# EAGLE design LED-zero-SHIM (EAGLE 9.6.2)

## Sheet 1 of 2
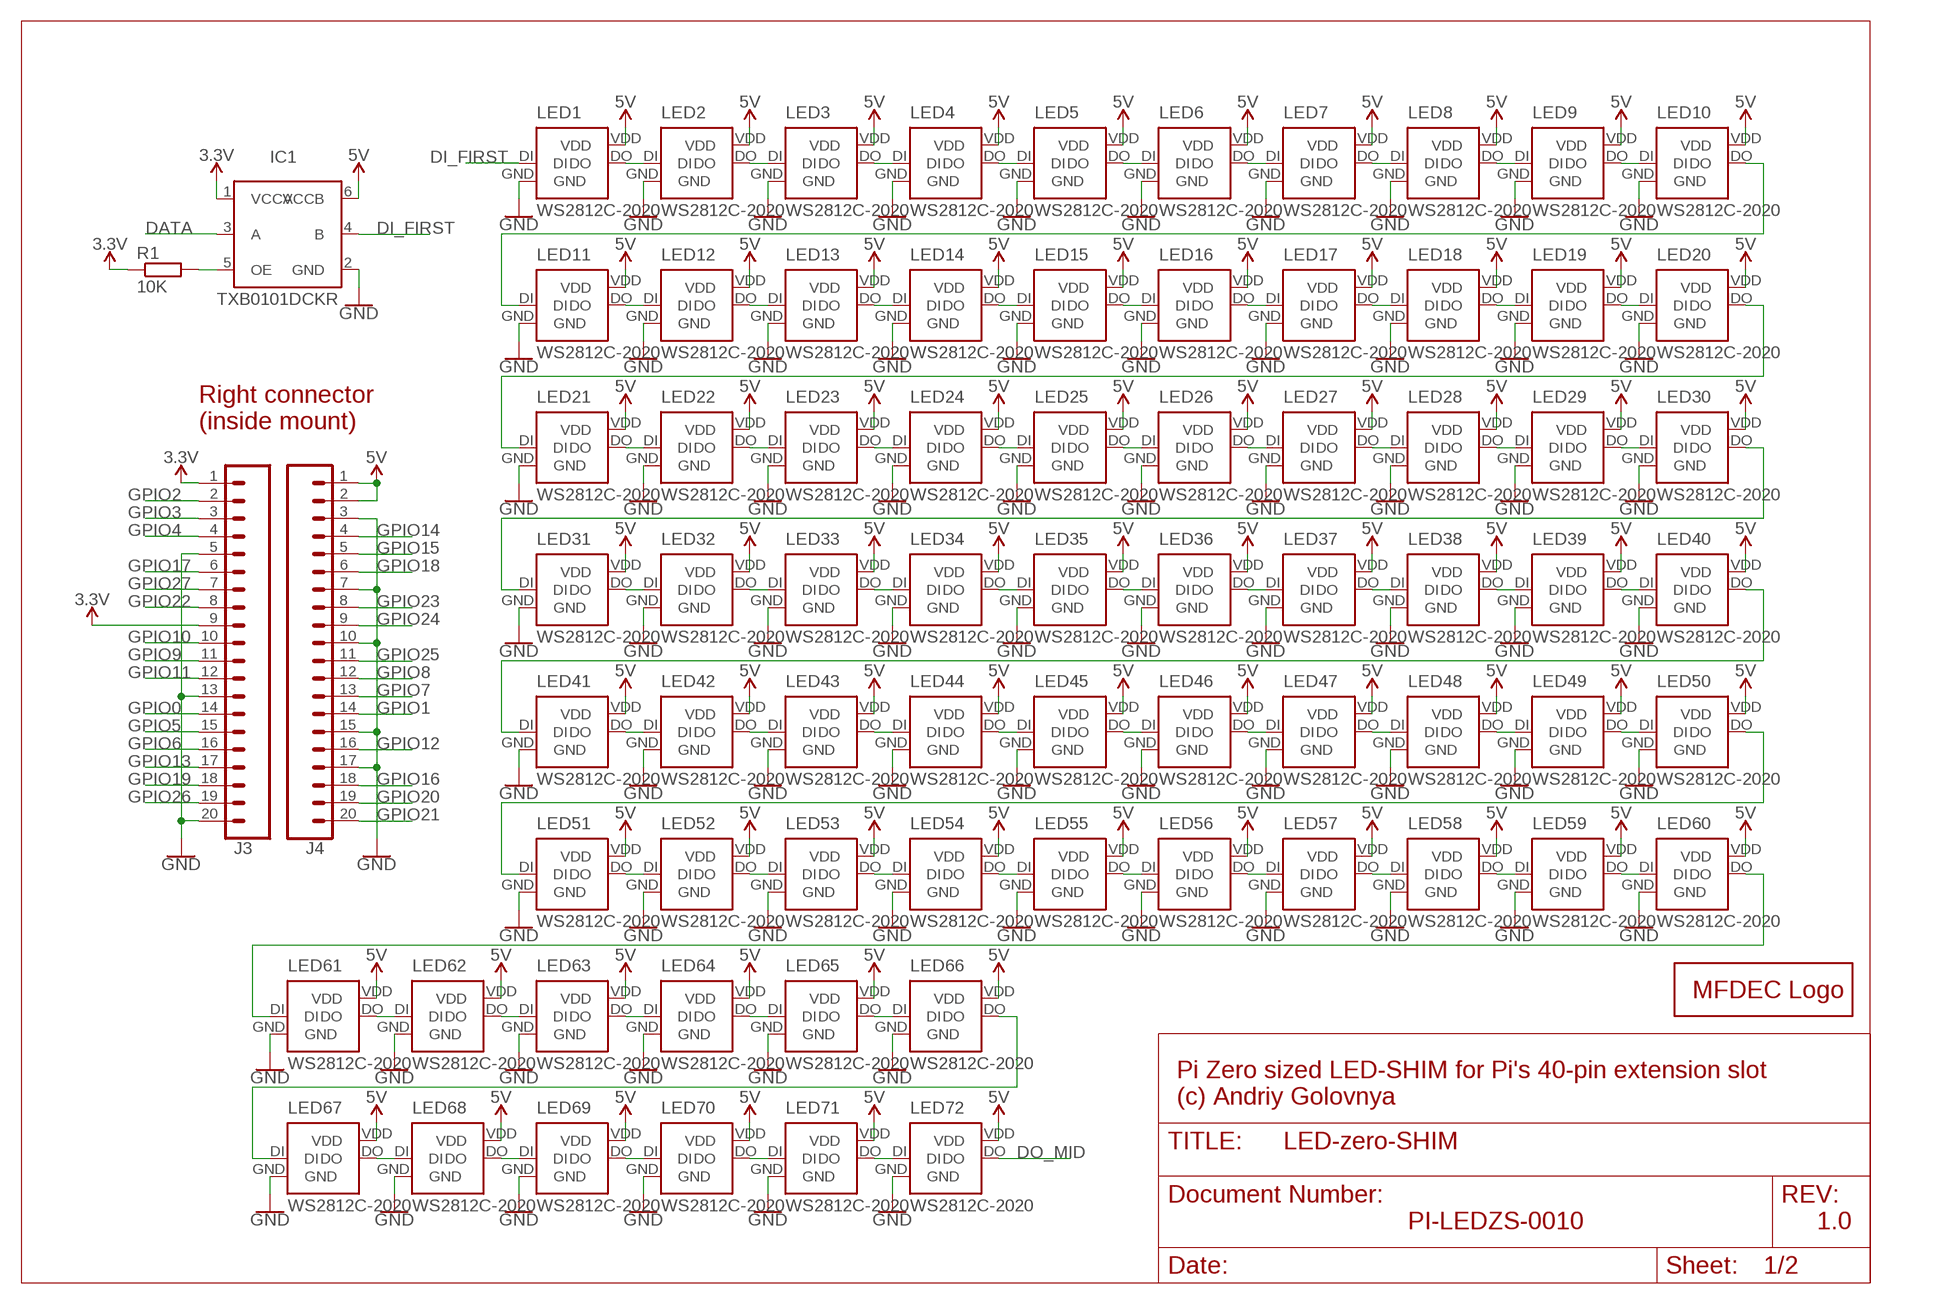
[diagram p0: schematic, sheet 1]

### Parts
IC1  TXB0101DCKR  [SOT65P210X110-6N]
J3  CONN_20LOCK  [1X20_LOCK]
J4  CONN_20LOCK  [1X20_LOCK]
LED1  WS2812C-2020  [WS2812X-2020]
LED2  WS2812C-2020  [WS2812X-2020]
LED3  WS2812C-2020  [WS2812X-2020]
LED4  WS2812C-2020  [WS2812X-2020]
LED5  WS2812C-2020  [WS2812X-2020]
LED6  WS2812C-2020  [WS2812X-2020]
LED7  WS2812C-2020  [WS2812X-2020]
LED8  WS2812C-2020  [WS2812X-2020]
LED9  WS2812C-2020  [WS2812X-2020]
LED10  WS2812C-2020  [WS2812X-2020]
LED11  WS2812C-2020  [WS2812X-2020]
LED12  WS2812C-2020  [WS2812X-2020]
LED13  WS2812C-2020  [WS2812X-2020]
LED14  WS2812C-2020  [WS2812X-2020]
LED15  WS2812C-2020  [WS2812X-2020]
LED16  WS2812C-2020  [WS2812X-2020]
LED17  WS2812C-2020  [WS2812X-2020]
LED18  WS2812C-2020  [WS2812X-2020]
LED19  WS2812C-2020  [WS2812X-2020]
LED20  WS2812C-2020  [WS2812X-2020]
LED21  WS2812C-2020  [WS2812X-2020]
LED22  WS2812C-2020  [WS2812X-2020]
LED23  WS2812C-2020  [WS2812X-2020]
LED24  WS2812C-2020  [WS2812X-2020]
LED25  WS2812C-2020  [WS2812X-2020]
LED26  WS2812C-2020  [WS2812X-2020]
LED27  WS2812C-2020  [WS2812X-2020]
LED28  WS2812C-2020  [WS2812X-2020]
LED29  WS2812C-2020  [WS2812X-2020]
LED30  WS2812C-2020  [WS2812X-2020]
LED31  WS2812C-2020  [WS2812X-2020]
LED32  WS2812C-2020  [WS2812X-2020]
LED33  WS2812C-2020  [WS2812X-2020]
LED34  WS2812C-2020  [WS2812X-2020]
LED35  WS2812C-2020  [WS2812X-2020]
LED36  WS2812C-2020  [WS2812X-2020]
LED37  WS2812C-2020  [WS2812X-2020]
LED38  WS2812C-2020  [WS2812X-2020]
LED39  WS2812C-2020  [WS2812X-2020]
LED40  WS2812C-2020  [WS2812X-2020]
LED41  WS2812C-2020  [WS2812X-2020]
LED42  WS2812C-2020  [WS2812X-2020]
LED43  WS2812C-2020  [WS2812X-2020]
LED44  WS2812C-2020  [WS2812X-2020]
LED45  WS2812C-2020  [WS2812X-2020]
LED46  WS2812C-2020  [WS2812X-2020]
LED47  WS2812C-2020  [WS2812X-2020]
LED48  WS2812C-2020  [WS2812X-2020]
LED49  WS2812C-2020  [WS2812X-2020]
LED50  WS2812C-2020  [WS2812X-2020]
LED51  WS2812C-2020  [WS2812X-2020]
LED52  WS2812C-2020  [WS2812X-2020]
LED53  WS2812C-2020  [WS2812X-2020]
LED54  WS2812C-2020  [WS2812X-2020]
LED55  WS2812C-2020  [WS2812X-2020]
LED56  WS2812C-2020  [WS2812X-2020]
LED57  WS2812C-2020  [WS2812X-2020]
LED58  WS2812C-2020  [WS2812X-2020]
LED59  WS2812C-2020  [WS2812X-2020]
LED60  WS2812C-2020  [WS2812X-2020]
LED61  WS2812C-2020  [WS2812X-2020]
LED62  WS2812C-2020  [WS2812X-2020]
LED63  WS2812C-2020  [WS2812X-2020]
LED64  WS2812C-2020  [WS2812X-2020]
LED65  WS2812C-2020  [WS2812X-2020]
LED66  WS2812C-2020  [WS2812X-2020]
LED67  WS2812C-2020  [WS2812X-2020]
LED68  WS2812C-2020  [WS2812X-2020]
LED69  WS2812C-2020  [WS2812X-2020]
LED70  WS2812C-2020  [WS2812X-2020]
LED71  WS2812C-2020  [WS2812X-2020]
LED72  WS2812C-2020  [WS2812X-2020]
LOGO1  MFDECLOGO_L_30MM  [MFDEC_L_30MM]
R1  10K  R-EU_R0402  [R0402]

### Nets
3.3V: IC1.1(VCCA) J3.1 J3.9 R1.1
5V: IC1.6(VCCB) J4.1 J4.2 LED1.VDD LED2.VDD LED3.VDD LED4.VDD LED5.VDD LED6.VDD LED7.VDD LED8.VDD LED9.VDD LED10.VDD LED11.VDD LED12.VDD LED13.VDD LED14.VDD LED15.VDD LED16.VDD LED17.VDD LED18.VDD LED19.VDD LED20.VDD LED21.VDD LED22.VDD LED23.VDD LED24.VDD LED25.VDD LED26.VDD LED27.VDD LED28.VDD LED29.VDD LED30.VDD LED31.VDD LED32.VDD LED33.VDD LED34.VDD LED35.VDD LED36.VDD LED37.VDD LED38.VDD LED39.VDD LED40.VDD LED41.VDD LED42.VDD LED43.VDD LED44.VDD LED45.VDD LED46.VDD LED47.VDD LED48.VDD LED49.VDD LED50.VDD LED51.VDD LED52.VDD LED53.VDD LED54.VDD LED55.VDD LED56.VDD LED57.VDD LED58.VDD LED59.VDD LED60.VDD LED61.VDD LED62.VDD LED63.VDD LED64.VDD LED65.VDD LED66.VDD LED67.VDD LED68.VDD LED69.VDD LED70.VDD LED71.VDD LED72.VDD ; also sheet 2
DATA: IC1.3(A) ; also sheet 2
DI_FIRST: IC1.4(B) LED1.DI ; also sheet 2
DO_MID: LED72.DO ; also sheet 2
GND: IC1.2(GND) J3.5 J3.13 J3.20 J4.3 J4.7 J4.10 J4.15 J4.17 LED1.GND LED2.GND LED3.GND LED4.GND LED5.GND LED6.GND LED7.GND LED8.GND LED9.GND LED10.GND LED11.GND LED12.GND LED13.GND LED14.GND LED15.GND LED16.GND LED17.GND LED18.GND LED19.GND LED20.GND LED21.GND LED22.GND LED23.GND LED24.GND LED25.GND LED26.GND LED27.GND LED28.GND LED29.GND LED30.GND LED31.GND LED32.GND LED33.GND LED34.GND LED35.GND LED36.GND LED37.GND LED38.GND LED39.GND LED40.GND LED41.GND LED42.GND LED43.GND LED44.GND LED45.GND LED46.GND LED47.GND LED48.GND LED49.GND LED50.GND LED51.GND LED52.GND LED53.GND LED54.GND LED55.GND LED56.GND LED57.GND LED58.GND LED59.GND LED60.GND LED61.GND LED62.GND LED63.GND LED64.GND LED65.GND LED66.GND LED67.GND LED68.GND LED69.GND LED70.GND LED71.GND LED72.GND ; also sheet 2
GPIO0: J3.14
GPIO1: J4.14
GPIO2: J3.2
GPIO3: J3.3
GPIO4: J3.4
GPIO5: J3.15
GPIO6: J3.16
GPIO7: J4.13
GPIO8: J4.12
GPIO9: J3.11
GPIO10: J3.10 ; also sheet 2
GPIO11: J3.12
GPIO12: J4.16
GPIO13: J3.17
GPIO14: J4.4
GPIO15: J4.5
GPIO16: J4.18
GPIO17: J3.6
GPIO18: J4.6 ; also sheet 2
GPIO19: J3.18
GPIO20: J4.19
GPIO21: J4.20 ; also sheet 2
GPIO22: J3.8
GPIO23: J4.8
GPIO24: J4.9
GPIO25: J4.11
GPIO26: J3.19
GPIO27: J3.7
N$1: LED1.DO LED2.DI
N$2: LED2.DO LED3.DI
N$3: LED3.DO LED4.DI
N$4: LED4.DO LED5.DI
N$5: LED5.DO LED6.DI
N$6: LED6.DO LED7.DI
N$7: LED7.DO LED8.DI
N$8: LED8.DO LED9.DI
N$9: LED9.DO LED10.DI
N$10: LED10.DO LED11.DI
N$11: LED11.DO LED12.DI
N$12: LED12.DO LED13.DI
N$13: LED13.DO LED14.DI
N$14: LED14.DO LED15.DI
N$15: LED15.DO LED16.DI
N$16: LED16.DO LED17.DI
N$17: LED17.DO LED18.DI
N$18: LED18.DO LED19.DI
N$19: LED19.DO LED20.DI
N$20: LED20.DO LED21.DI
N$21: LED21.DO LED22.DI
N$22: LED22.DO LED23.DI
N$23: LED23.DO LED24.DI
N$24: LED24.DO LED25.DI
N$25: LED25.DO LED26.DI
N$26: LED26.DO LED27.DI
N$27: LED27.DO LED28.DI
N$28: LED28.DO LED29.DI
N$29: LED29.DO LED30.DI
N$30: LED30.DO LED31.DI
N$31: LED31.DO LED32.DI
N$32: LED32.DO LED33.DI
N$33: LED33.DO LED34.DI
N$34: LED34.DO LED35.DI
N$35: LED35.DO LED36.DI
N$36: LED36.DO LED37.DI
N$37: LED37.DO LED38.DI
N$38: LED38.DO LED39.DI
N$39: LED39.DO LED40.DI
N$40: LED40.DO LED41.DI
N$41: LED41.DO LED42.DI
N$42: LED42.DO LED43.DI
N$43: LED43.DO LED44.DI
N$44: LED44.DO LED45.DI
N$45: LED45.DO LED46.DI
N$46: LED46.DO LED47.DI
N$47: LED47.DO LED48.DI
N$48: LED48.DO LED49.DI
N$49: LED49.DO LED50.DI
N$50: LED50.DO LED51.DI
N$51: LED51.DO LED52.DI
N$52: LED52.DO LED53.DI
N$53: LED53.DO LED54.DI
N$54: LED54.DO LED55.DI
N$55: LED55.DO LED56.DI
N$56: LED56.DO LED57.DI
N$57: LED57.DO LED58.DI
N$58: LED58.DO LED59.DI
N$59: LED59.DO LED60.DI
N$60: LED60.DO LED61.DI
N$61: LED61.DO LED62.DI
N$62: LED62.DO LED63.DI
N$63: LED63.DO LED64.DI
N$64: LED64.DO LED65.DI
N$65: LED65.DO LED66.DI
N$66: LED66.DO LED67.DI
N$67: LED67.DO LED68.DI
N$68: LED68.DO LED69.DI
N$69: LED69.DO LED70.DI
N$70: LED70.DO LED71.DI
N$71: LED71.DO LED72.DI
N$143: IC1.5(OE) R1.2

### Notes on the sheet
- Right connector
  (inside mount)
- Pi Zero sized LED-SHIM for Pi's 40-pin extension slot
  (c) Andriy Golovnya
- PI-LEDZS-0010 | 1.0

## Sheet 2 of 2
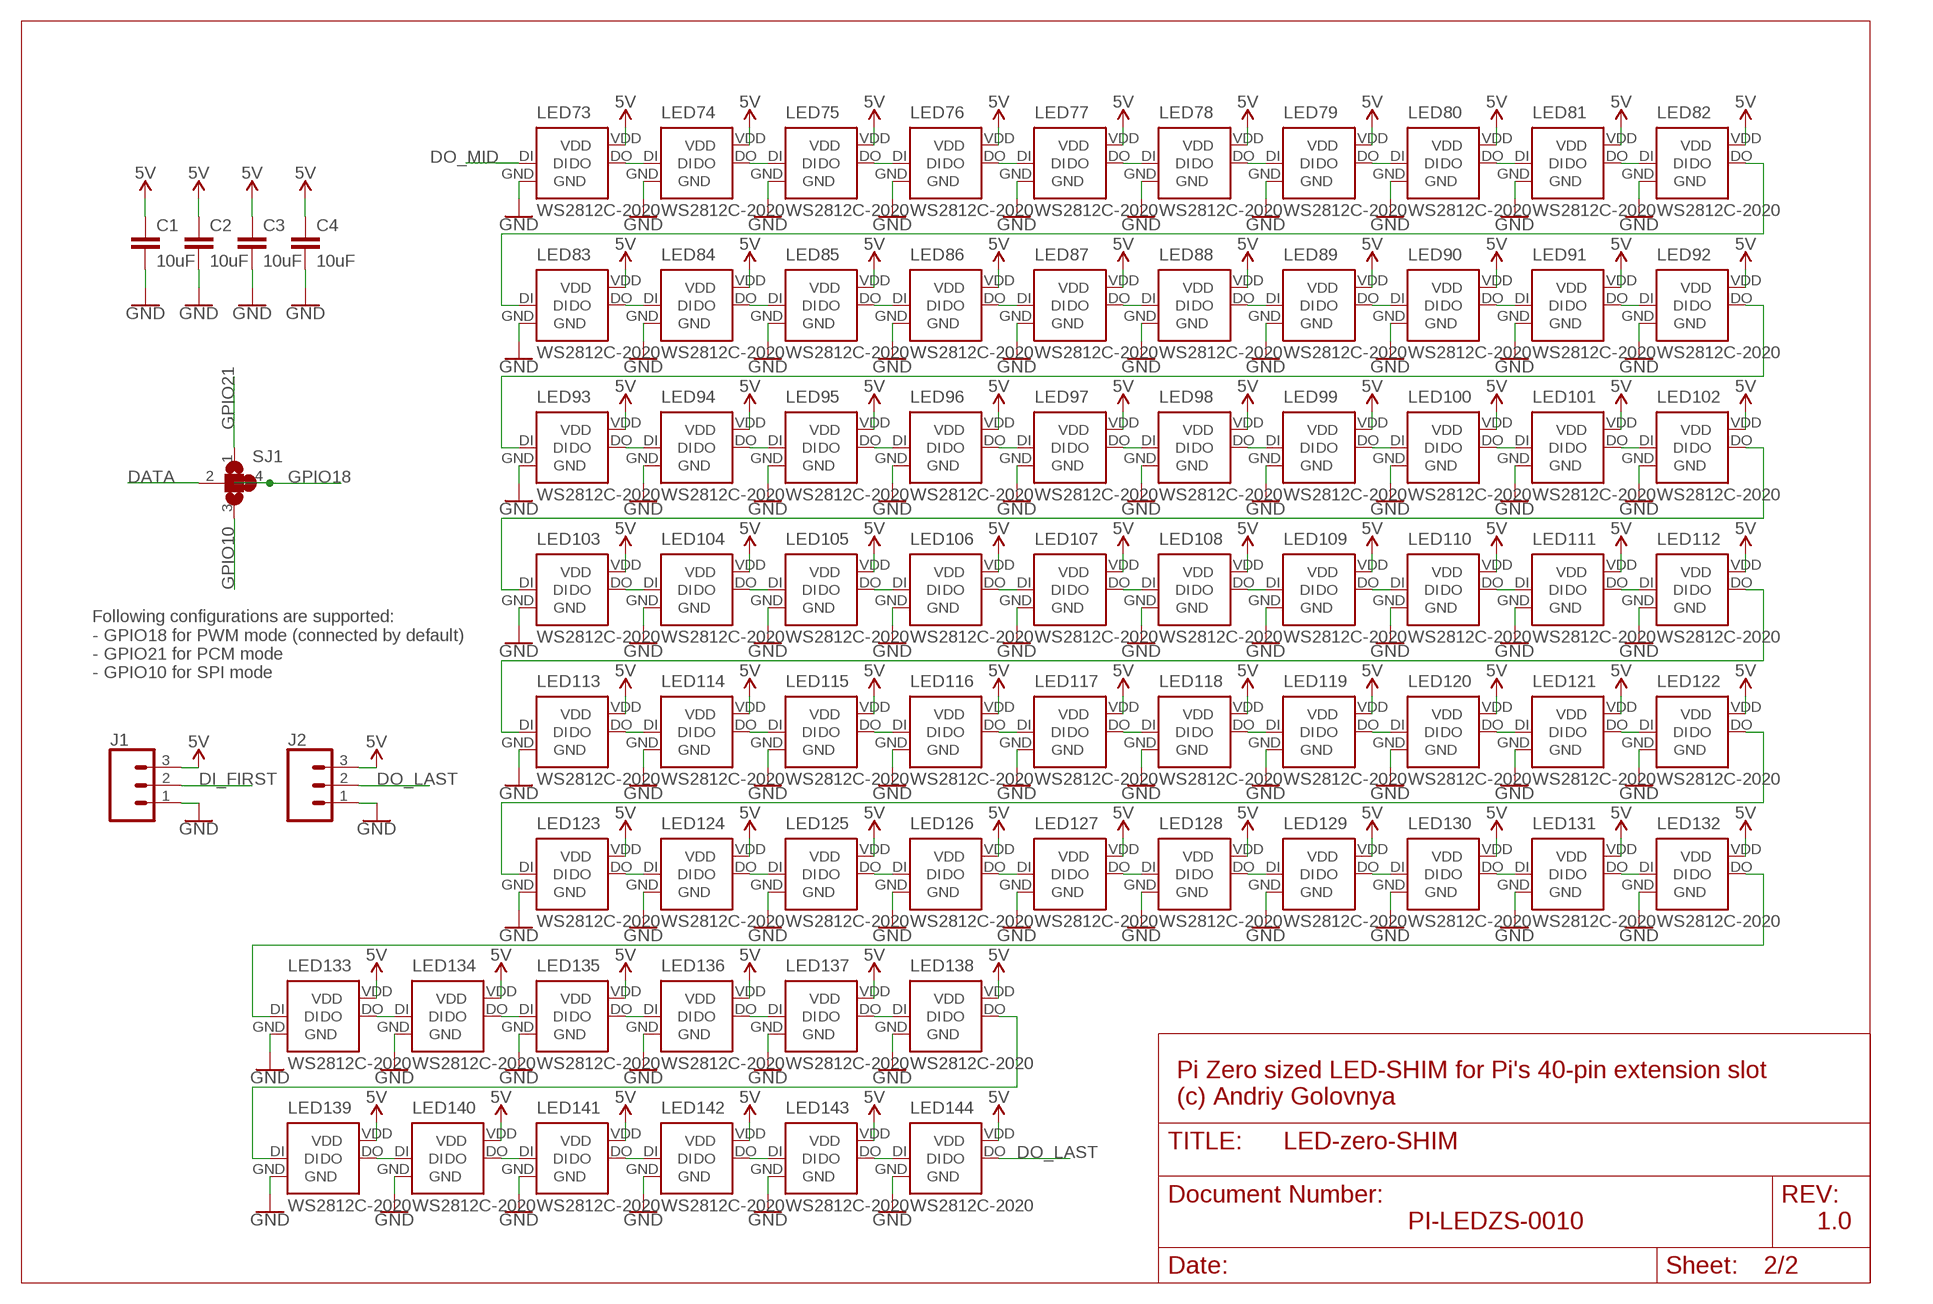
[diagram p1: schematic, sheet 2]

### Parts
C1  10uF  C-EUC0805  [C0805]
C2  10uF  C-EUC0805  [C0805]
C3  10uF  C-EUC0805  [C0805]
C4  10uF  C-EUC0805  [C0805]
J1  CONN_03  [1X03]
J2  CONN_03  [1X03]
LED73  WS2812C-2020  [WS2812X-2020]
LED74  WS2812C-2020  [WS2812X-2020]
LED75  WS2812C-2020  [WS2812X-2020]
LED76  WS2812C-2020  [WS2812X-2020]
LED77  WS2812C-2020  [WS2812X-2020]
LED78  WS2812C-2020  [WS2812X-2020]
LED79  WS2812C-2020  [WS2812X-2020]
LED80  WS2812C-2020  [WS2812X-2020]
LED81  WS2812C-2020  [WS2812X-2020]
LED82  WS2812C-2020  [WS2812X-2020]
LED83  WS2812C-2020  [WS2812X-2020]
LED84  WS2812C-2020  [WS2812X-2020]
LED85  WS2812C-2020  [WS2812X-2020]
LED86  WS2812C-2020  [WS2812X-2020]
LED87  WS2812C-2020  [WS2812X-2020]
LED88  WS2812C-2020  [WS2812X-2020]
LED89  WS2812C-2020  [WS2812X-2020]
LED90  WS2812C-2020  [WS2812X-2020]
LED91  WS2812C-2020  [WS2812X-2020]
LED92  WS2812C-2020  [WS2812X-2020]
LED93  WS2812C-2020  [WS2812X-2020]
LED94  WS2812C-2020  [WS2812X-2020]
LED95  WS2812C-2020  [WS2812X-2020]
LED96  WS2812C-2020  [WS2812X-2020]
LED97  WS2812C-2020  [WS2812X-2020]
LED98  WS2812C-2020  [WS2812X-2020]
LED99  WS2812C-2020  [WS2812X-2020]
LED100  WS2812C-2020  [WS2812X-2020]
LED101  WS2812C-2020  [WS2812X-2020]
LED102  WS2812C-2020  [WS2812X-2020]
LED103  WS2812C-2020  [WS2812X-2020]
LED104  WS2812C-2020  [WS2812X-2020]
LED105  WS2812C-2020  [WS2812X-2020]
LED106  WS2812C-2020  [WS2812X-2020]
LED107  WS2812C-2020  [WS2812X-2020]
LED108  WS2812C-2020  [WS2812X-2020]
LED109  WS2812C-2020  [WS2812X-2020]
LED110  WS2812C-2020  [WS2812X-2020]
LED111  WS2812C-2020  [WS2812X-2020]
LED112  WS2812C-2020  [WS2812X-2020]
LED113  WS2812C-2020  [WS2812X-2020]
LED114  WS2812C-2020  [WS2812X-2020]
LED115  WS2812C-2020  [WS2812X-2020]
LED116  WS2812C-2020  [WS2812X-2020]
LED117  WS2812C-2020  [WS2812X-2020]
LED118  WS2812C-2020  [WS2812X-2020]
LED119  WS2812C-2020  [WS2812X-2020]
LED120  WS2812C-2020  [WS2812X-2020]
LED121  WS2812C-2020  [WS2812X-2020]
LED122  WS2812C-2020  [WS2812X-2020]
LED123  WS2812C-2020  [WS2812X-2020]
LED124  WS2812C-2020  [WS2812X-2020]
LED125  WS2812C-2020  [WS2812X-2020]
LED126  WS2812C-2020  [WS2812X-2020]
LED127  WS2812C-2020  [WS2812X-2020]
LED128  WS2812C-2020  [WS2812X-2020]
LED129  WS2812C-2020  [WS2812X-2020]
LED130  WS2812C-2020  [WS2812X-2020]
LED131  WS2812C-2020  [WS2812X-2020]
LED132  WS2812C-2020  [WS2812X-2020]
LED133  WS2812C-2020  [WS2812X-2020]
LED134  WS2812C-2020  [WS2812X-2020]
LED135  WS2812C-2020  [WS2812X-2020]
LED136  WS2812C-2020  [WS2812X-2020]
LED137  WS2812C-2020  [WS2812X-2020]
LED138  WS2812C-2020  [WS2812X-2020]
LED139  WS2812C-2020  [WS2812X-2020]
LED140  WS2812C-2020  [WS2812X-2020]
LED141  WS2812C-2020  [WS2812X-2020]
LED142  WS2812C-2020  [WS2812X-2020]
LED143  WS2812C-2020  [WS2812X-2020]
LED144  WS2812C-2020  [WS2812X-2020]
SJ1  SJ3  [SJ_3]

### Nets
5V: C1.1 C2.1 C3.1 C4.1 J1.3 J2.3 LED73.VDD LED74.VDD LED75.VDD LED76.VDD LED77.VDD LED78.VDD LED79.VDD LED80.VDD LED81.VDD LED82.VDD LED83.VDD LED84.VDD LED85.VDD LED86.VDD LED87.VDD LED88.VDD LED89.VDD LED90.VDD LED91.VDD LED92.VDD LED93.VDD LED94.VDD LED95.VDD LED96.VDD LED97.VDD LED98.VDD LED99.VDD LED100.VDD LED101.VDD LED102.VDD LED103.VDD LED104.VDD LED105.VDD LED106.VDD LED107.VDD LED108.VDD LED109.VDD LED110.VDD LED111.VDD LED112.VDD LED113.VDD LED114.VDD LED115.VDD LED116.VDD LED117.VDD LED118.VDD LED119.VDD LED120.VDD LED121.VDD LED122.VDD LED123.VDD LED124.VDD LED125.VDD LED126.VDD LED127.VDD LED128.VDD LED129.VDD LED130.VDD LED131.VDD LED132.VDD LED133.VDD LED134.VDD LED135.VDD LED136.VDD LED137.VDD LED138.VDD LED139.VDD LED140.VDD LED141.VDD LED142.VDD LED143.VDD LED144.VDD ; also sheet 1
DATA: SJ1.2 ; also sheet 1
DI_FIRST: J1.2 ; also sheet 1
DO_LAST: J2.2 LED144.DO
DO_MID: LED73.DI ; also sheet 1
GND: C1.2 C2.2 C3.2 C4.2 J1.1 J2.1 LED73.GND LED74.GND LED75.GND LED76.GND LED77.GND LED78.GND LED79.GND LED80.GND LED81.GND LED82.GND LED83.GND LED84.GND LED85.GND LED86.GND LED87.GND LED88.GND LED89.GND LED90.GND LED91.GND LED92.GND LED93.GND LED94.GND LED95.GND LED96.GND LED97.GND LED98.GND LED99.GND LED100.GND LED101.GND LED102.GND LED103.GND LED104.GND LED105.GND LED106.GND LED107.GND LED108.GND LED109.GND LED110.GND LED111.GND LED112.GND LED113.GND LED114.GND LED115.GND LED116.GND LED117.GND LED118.GND LED119.GND LED120.GND LED121.GND LED122.GND LED123.GND LED124.GND LED125.GND LED126.GND LED127.GND LED128.GND LED129.GND LED130.GND LED131.GND LED132.GND LED133.GND LED134.GND LED135.GND LED136.GND LED137.GND LED138.GND LED139.GND LED140.GND LED141.GND LED142.GND LED143.GND LED144.GND ; also sheet 1
GPIO10: SJ1.3 ; also sheet 1
GPIO18: SJ1.4 ; also sheet 1
GPIO21: SJ1.1 ; also sheet 1
N$72: LED73.DO LED74.DI
N$73: LED74.DO LED75.DI
N$74: LED75.DO LED76.DI
N$75: LED76.DO LED77.DI
N$76: LED77.DO LED78.DI
N$77: LED78.DO LED79.DI
N$78: LED79.DO LED80.DI
N$79: LED80.DO LED81.DI
N$80: LED81.DO LED82.DI
N$81: LED82.DO LED83.DI
N$82: LED83.DO LED84.DI
N$83: LED84.DO LED85.DI
N$84: LED85.DO LED86.DI
N$85: LED86.DO LED87.DI
N$86: LED87.DO LED88.DI
N$87: LED88.DO LED89.DI
N$88: LED89.DO LED90.DI
N$89: LED90.DO LED91.DI
N$90: LED91.DO LED92.DI
N$91: LED92.DO LED93.DI
N$92: LED93.DO LED94.DI
N$93: LED94.DO LED95.DI
N$94: LED95.DO LED96.DI
N$95: LED96.DO LED97.DI
N$96: LED97.DO LED98.DI
N$97: LED98.DO LED99.DI
N$98: LED99.DO LED100.DI
N$99: LED100.DO LED101.DI
N$100: LED101.DO LED102.DI
N$101: LED102.DO LED103.DI
N$102: LED103.DO LED104.DI
N$103: LED104.DO LED105.DI
N$104: LED105.DO LED106.DI
N$105: LED106.DO LED107.DI
N$106: LED107.DO LED108.DI
N$107: LED108.DO LED109.DI
N$108: LED109.DO LED110.DI
N$109: LED110.DO LED111.DI
N$110: LED111.DO LED112.DI
N$111: LED112.DO LED113.DI
N$112: LED113.DO LED114.DI
N$113: LED114.DO LED115.DI
N$114: LED115.DO LED116.DI
N$115: LED116.DO LED117.DI
N$116: LED117.DO LED118.DI
N$117: LED118.DO LED119.DI
N$118: LED119.DO LED120.DI
N$119: LED120.DO LED121.DI
N$120: LED121.DO LED122.DI
N$121: LED122.DO LED123.DI
N$122: LED123.DO LED124.DI
N$123: LED124.DO LED125.DI
N$124: LED125.DO LED126.DI
N$125: LED126.DO LED127.DI
N$126: LED127.DO LED128.DI
N$127: LED128.DO LED129.DI
N$128: LED129.DO LED130.DI
N$129: LED130.DO LED131.DI
N$130: LED131.DO LED132.DI
N$131: LED132.DO LED133.DI
N$132: LED133.DO LED134.DI
N$133: LED134.DO LED135.DI
N$134: LED135.DO LED136.DI
N$135: LED136.DO LED137.DI
N$136: LED137.DO LED138.DI
N$137: LED138.DO LED139.DI
N$138: LED139.DO LED140.DI
N$139: LED140.DO LED141.DI
N$140: LED141.DO LED142.DI
N$141: LED142.DO LED143.DI
N$142: LED143.DO LED144.DI

### Notes on the sheet
- Following configurations are supported:
  - GPIO18 for PWM mode (connected by default)
  - GPIO21 for PCM mode
  - GPIO10 for SPI mode
- Pi Zero sized LED-SHIM for Pi's 40-pin extension slot
  (c) Andriy Golovnya
- PI-LEDZS-0010 | 1.0

## Library data of the parts
C1-C4 = rcl:C-EU: CAPACITOR, European symbol; SPICEPREFIX: C
IC1 = TXB0101DCKR:TXB0101DCKR
J1 J2 = SparkFun-Connectors:CONN_03: Multi connection point. Often used as Generic Header-pin footprint for 0.1 inch spaced/style header connections On any of the 0.1 inch spaced packages, you can populate with these: Break Away Headers - Straight <https://www.sparkfun.com/products/116> (PRT-00116) Break Away Male Headers - Right Angle <https://www.sparkfun.com/products/553> (PRT-00553) Female Headers <https://www.sparkfun.com/products/115> (PRT-00115) Break Away Headers - Machine Pin <https://www.sparkfun.com/products/117> (PRT-00117) Break Away Female Headers - Swiss Machine Pin <https://www.sparkfun.com/products/743> (PRT-00743) Stackable Header - 3 Pin (Female, 0.1") <https://www.sparkfun.com/products/13875> (PRT-13875) For SCREWTERMINALS and SPRING TERMINALS visit here: Screw Terimnals on SparkFun.com <https://www.sparkfun.com/search/results?term=Screw+Terminals> (5mm/3.5mm/2.54mm spacing) This device is also useful as a general connection point to wire up your design to another part of your project. Our various solder wires solder well into these plated through hole pads. Hook-Up Wire - Assortment (Stranded, 22 AWG) <https://www.sparkfun.com/products/11375> (PRT-11375) Hook-Up Wire - Assortment (Solid Core, 22 AWG) <https://www.sparkfun.com/products/11367> (PRT-11367) View the entire wire category on our website here <https://www.sparkfun.com/categories/141> Special notes: Molex polarized connector foot print use with SKU : PRT-08232 with associated crimp pins and housings.
J3 J4 = _my_locked_connectors:CONN_20: Multi connection point. Often used as Generic Header-pin footprint for 0.1 inch spaced/style header connections On any of the 0.1 inch spaced packages, you can populate with these: Break Away Headers - Straight <https://www.sparkfun.com/products/116> (PRT-00116) Break Away Male Headers - Right Angle <https://www.sparkfun.com/products/553> (PRT-00553) Female Headers <https://www.sparkfun.com/products/115> (PRT-00115) Break Away Headers - Machine Pin <https://www.sparkfun.com/products/117> (PRT-00117) Break Away Female Headers - Swiss Machine Pin <https://www.sparkfun.com/products/743> (PRT-00743) For SCREWTERMINALS and SPRING TERMINALS visit here: Screw Terimnals on SparkFun.com <https://www.sparkfun.com/search/results?term=Screw+Terminals> (5mm/3.5mm/2.54mm spacing) This device is also useful as a general connection point to wire up your design to another part of your project. Our various solder wires solder well into these plated through hole pads. Hook-Up Wire - Assortment (Stranded, 22 AWG) <https://www.sparkfun.com/products/11375> (PRT-11375) Hook-Up Wire - Assortment (Solid Core, 22 AWG) <https://www.sparkfun.com/products/11367> (PRT-11367) View the entire wire category on our website here <https://www.sparkfun.com/categories/141> Special notes: Molex polarized connector foot print use with SKU : PRT-08231 with associated crimp pins and housings. 1MM SMD Version SKU: PRT-10208 NOTES ON THE VARIANTS LOCK and LOCK_LONGPADS... This footprint was designed to help hold the alignment of a through-hole component (i.e. 6-pin header) while soldering it into place. You may notice that each hole has been shifted either up or down by 0.005 of an inch from it's more standard position (which is a perfectly straight line). This slight alteration caused the pins (the squares in the middle) to touch the edges of the holes. Because they are alternating, it causes a "brace" to hold the component in place. 0.005 has proven to be the perfect amount of "off-center" position when using our standard breakaway headers. Although looks a little odd when you look at the bare footprint, once you have a header in there, the alteration is very hard to notice. Also,if you push a header all the way into place, it is covered up entirely on the bottom side. Note about LOCK SPECIAL package: This is just like the LOCK variant in that the holes are staggared by 5 mil, but except for the last two holes. They are not altered from the "standard" footprint layout. This is used for a special purpose on the layout of our Graphic LCD Backpack. Make sure you want to use this device before selecting it for you project!
LED1-LED144 = WS281X:WS2812: WS2812 RGB LED
LOGO1 = _my_logos:MFDECLOGO: Midnight Fog - Digital Eye Candy LOGO
R1 = rcl:R-EU_: RESISTOR, European symbol; SPICEPREFIX: R
SJ1 = _my_jumpers:SJ3: SMD solder JUMPER SJ3 - simple jumper SJ3FI - fancy inside jumper SJ3FO - fancy outside jumper SJ3W - wide jumper

## Board
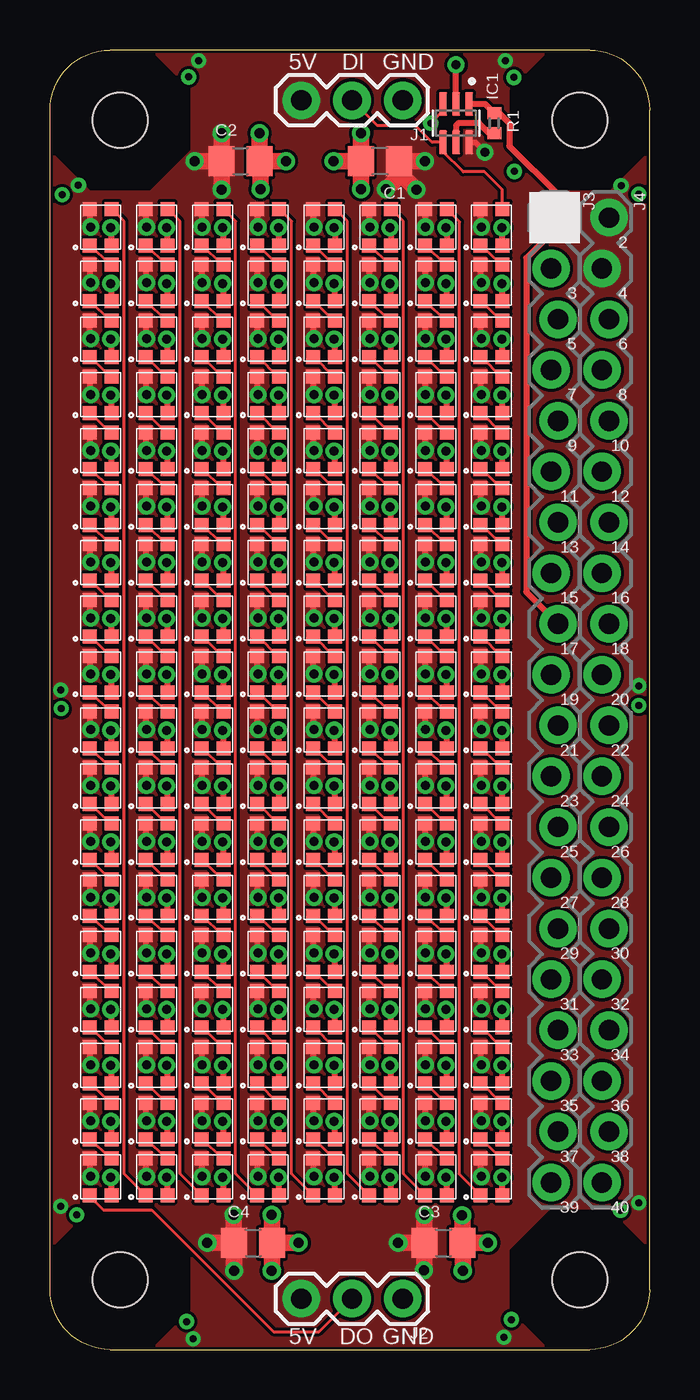
[diagram p2: board, top side]
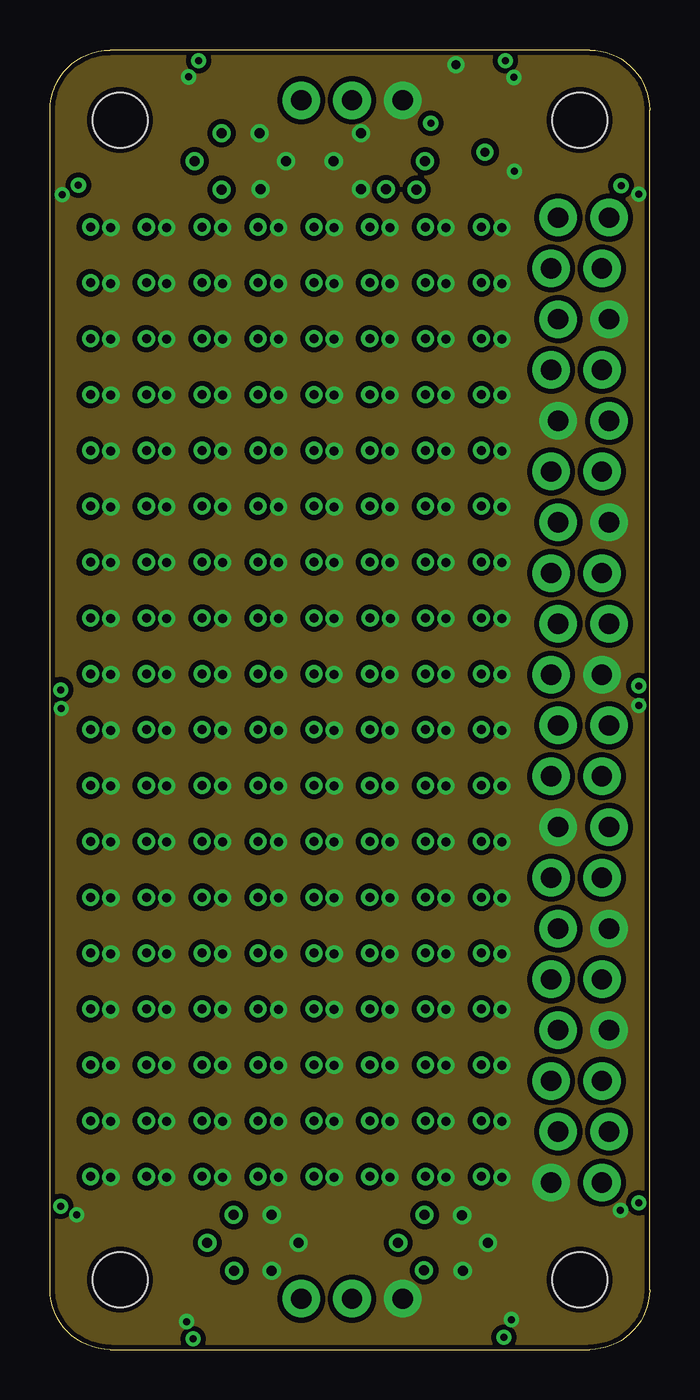
[diagram p3: board, inner layer Route2]
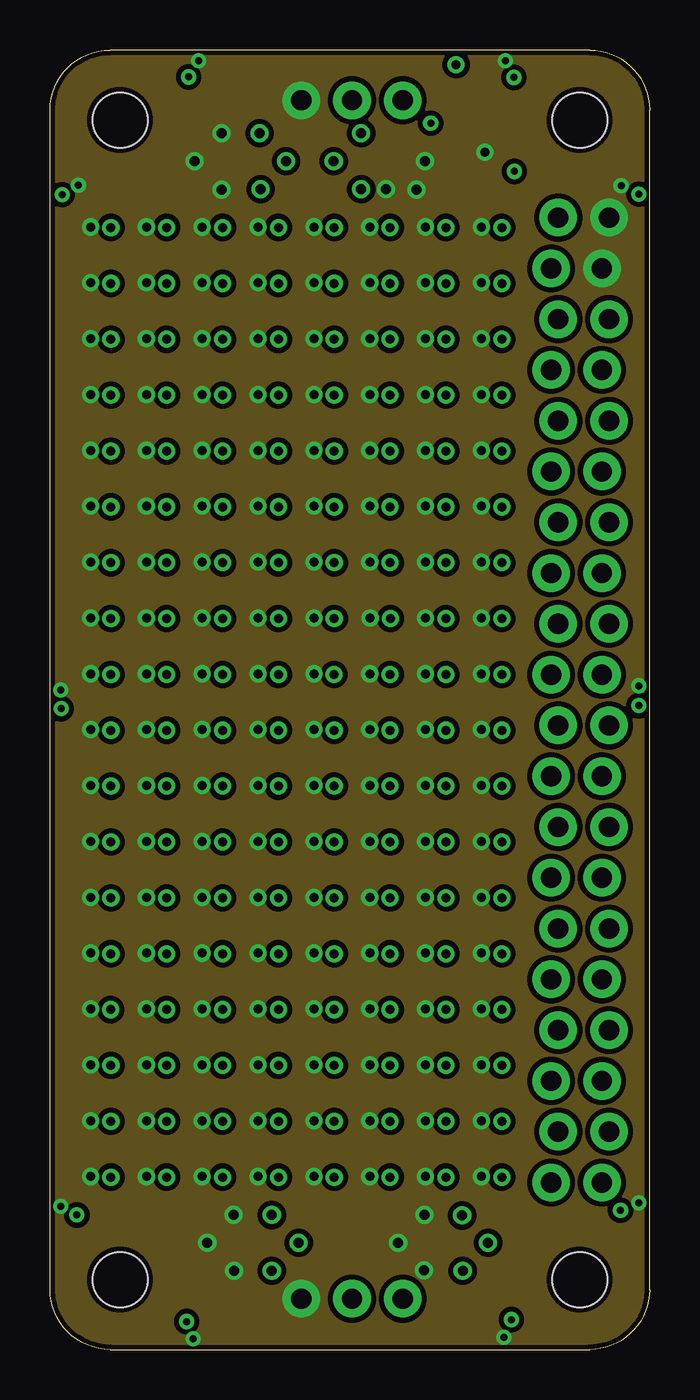
[diagram p4: board, inner layer Route15]
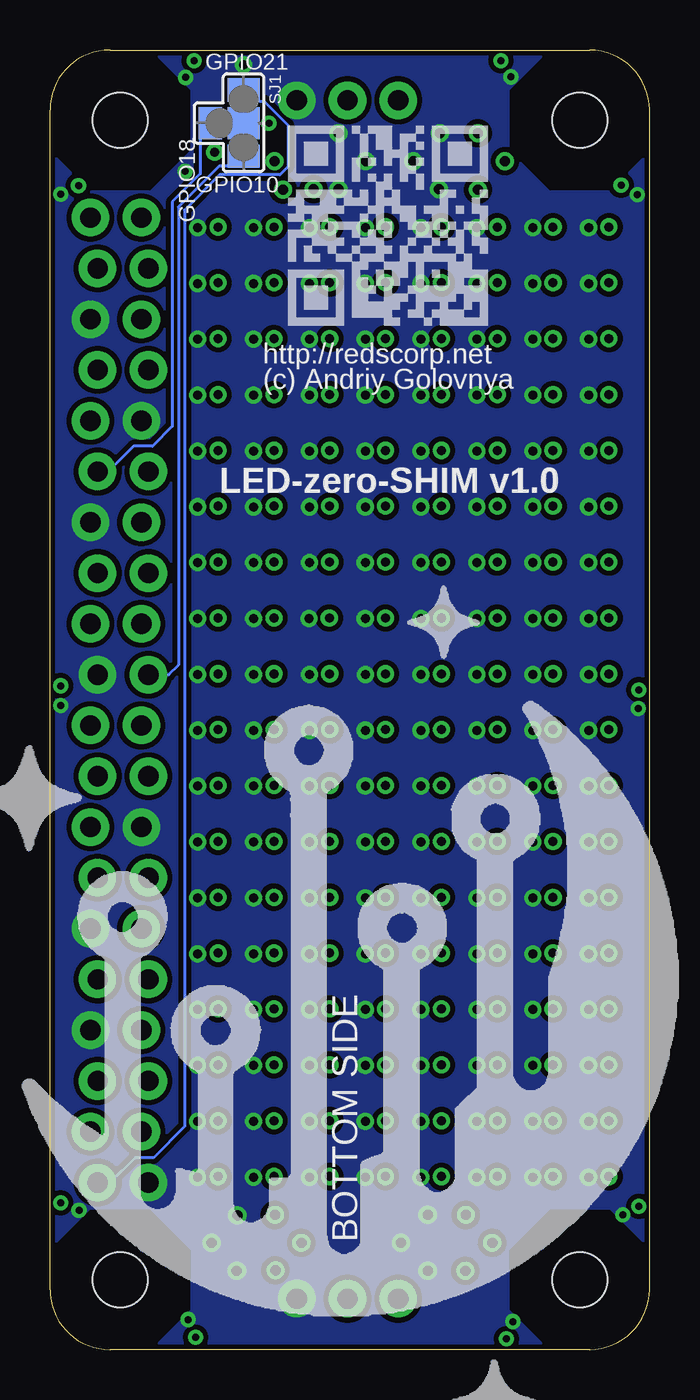
[diagram p5: board, bottom side, seen from below]

Size 30 x 65 mm. Coordinates in mm from the lower left corner, seen from the top.
Outline: 0,3 arc90 3,0 27,0 arc90 30,3 30,62 arc90 27,65 3,65 arc90 0,62
Outline: 0,3 arc0 0,3
Outline: 0,62 arc0 0,62
Outline: 0,3 0,62
Copper layers (1+2*15+16): Top 0.035mm / dielectric 0.2mm / Route2 0.035mm / dielectric 1.5mm / Route15 0.035mm / dielectric 0.2mm / Bottom 0.035mm
Design rules "default *": minimum track width 6mil, minimum drill 0.35mm, track to track 6mil, track to pad 6mil, pad to pad 6mil, via to via 6mil, smd to smd 6mil, copper to edge 6mil, drill to drill 6mil, minimum pad ring 10mil, minimum via ring 8mil, stop-mask expansion 4mil, vias tented up to drill 20mil, thermal gap 10mil
Holes 2.75 mm at 3.5,3.5 26.5,3.5 3.5,61.5 26.5,61.5

### Footprints (pad centres in the part's own frame; a part is rotated, then mirrored left to right if it is on the bottom)
C0805 = smd 1.3 x 1.5: 1 -0.95,0; 2 0.95,0
SOT65P210X110-6N = smd 1.19 x 0.4: 1 -0.96,0.65; 2 -0.96,0; 3 -0.96,-0.65; 4 0.96,-0.65; 5 0.96,0; 6 0.96,0.65
1X03 = drill 1.016 pad 1.88: 1 0,0; 2 2.54,0; 3 5.08,0
1X20_LOCK = drill 1.016 pad 1.88: 1 0,0.178; 2 2.54,-0.178; 3 5.08,0.178; 4 7.62,-0.178; 5 10.16,0.178; 6 12.7,-0.178; 7 15.24,0.178; 8 17.78,-0.178; 9 20.32,0.178; 10 22.86,-0.178; 11 25.4,0.178; 12 27.94,-0.178; 13 30.48,0.178; 14 33.02,-0.178; 15 35.56,0.178; 16 38.1,-0.178; 17 40.64,0.178; 18 43.18,-0.178; 19 45.72,0.178; 20 48.26,-0.178
WS2812X-2020 = smd 0.7 x 0.7: DI -0.915,0.55; DO 0.915,-0.55; GND 0.915,0.55; VDD -0.915,-0.55
R0402 = smd 0.6 x 0.7: 1 -0.5,0; 2 0.5,0
SJ_3 = smd 1.168 x 1.6: 1 -1.651,0; 3 1.651,0 | smd 1.6 x 1.6: 2 0,0 | smd 1.6 x 1.168: 4 0,-1.651

### Placement (x,y rotation side)
C1  16.51,59.44 180 top
C2  9.53,59.44 0 top
C3  19.69,5.33 0 top
C4  10.16,5.33 0 top
IC1  20.32,61.34 270 top
J1  17.65,62.48 180 top
J2  17.65,2.54 180 top
J3  25.25,56.62 270 top
J4  27.79,56.62 270 top
LED1  22.1,56.13 270 top
LED2  22.1,53.34 270 top
LED3  22.1,50.55 270 top
LED4  22.1,47.75 270 top
LED5  22.1,44.96 270 top
LED6  22.1,42.16 270 top
LED7  22.1,39.37 270 top
LED8  22.1,36.58 270 top
LED9  22.1,33.78 270 top
LED10  22.1,30.99 270 top
LED11  22.1,28.19 270 top
LED12  22.1,25.4 270 top
LED13  22.1,22.61 270 top
LED14  22.1,19.81 270 top
LED15  22.1,17.02 270 top
LED16  22.1,14.22 270 top
LED17  22.1,11.43 270 top
LED18  22.1,8.64 270 top
LED19  19.3,56.13 270 top
LED20  19.3,53.34 270 top
LED21  19.3,50.55 270 top
LED22  19.3,47.75 270 top
LED23  19.3,44.96 270 top
LED24  19.3,42.16 270 top
LED25  19.3,39.37 270 top
LED26  19.3,36.58 270 top
LED27  19.3,33.78 270 top
LED28  19.3,30.99 270 top
LED29  19.3,28.19 270 top
LED30  19.3,25.4 270 top
LED31  19.3,22.61 270 top
LED32  19.3,19.81 270 top
LED33  19.3,17.02 270 top
LED34  19.3,14.22 270 top
LED35  19.3,11.43 270 top
LED36  19.3,8.64 270 top
LED37  16.51,56.13 270 top
LED38  16.51,53.34 270 top
LED39  16.51,50.55 270 top
LED40  16.51,47.75 270 top
LED41  16.51,44.96 270 top
LED42  16.51,42.16 270 top
LED43  16.51,39.37 270 top
LED44  16.51,36.58 270 top
LED45  16.51,33.78 270 top
LED46  16.51,30.99 270 top
LED47  16.51,28.19 270 top
LED48  16.51,25.4 270 top
LED49  16.51,22.61 270 top
LED50  16.51,19.81 270 top
LED51  16.51,17.02 270 top
LED52  16.51,14.22 270 top
LED53  16.51,11.43 270 top
LED54  16.51,8.64 270 top
LED55  13.72,56.13 270 top
LED56  13.72,53.34 270 top
LED57  13.72,50.55 270 top
LED58  13.72,47.75 270 top
LED59  13.72,44.96 270 top
LED60  13.72,42.16 270 top
LED61  13.72,39.37 270 top
LED62  13.72,36.58 270 top
LED63  13.72,33.78 270 top
LED64  13.72,30.99 270 top
LED65  13.72,28.19 270 top
LED66  13.72,25.4 270 top
LED67  13.72,22.61 270 top
LED68  13.72,19.81 270 top
LED69  13.72,17.02 270 top
LED70  13.72,14.22 270 top
LED71  13.72,11.43 270 top
LED72  13.72,8.64 270 top
LED73  10.92,56.13 270 top
LED74  10.92,53.34 270 top
LED75  10.92,50.55 270 top
LED76  10.92,47.75 270 top
LED77  10.92,44.96 270 top
LED78  10.92,42.16 270 top
LED79  10.92,39.37 270 top
LED80  10.92,36.58 270 top
LED81  10.92,33.78 270 top
LED82  10.92,30.99 270 top
LED83  10.92,28.19 270 top
LED84  10.92,25.4 270 top
LED85  10.92,22.61 270 top
LED86  10.92,19.81 270 top
LED87  10.92,17.02 270 top
LED88  10.92,14.22 270 top
LED89  10.92,11.43 270 top
LED90  10.92,8.64 270 top
LED91  8.13,56.13 270 top
LED92  8.13,53.34 270 top
LED93  8.13,50.55 270 top
LED94  8.13,47.75 270 top
LED95  8.13,44.96 270 top
LED96  8.13,42.16 270 top
LED97  8.13,39.37 270 top
LED98  8.13,36.58 270 top
LED99  8.13,33.78 270 top
LED100  8.13,30.99 270 top
LED101  8.13,28.19 270 top
LED102  8.13,25.4 270 top
LED103  8.13,22.61 270 top
LED104  8.13,19.81 270 top
LED105  8.13,17.02 270 top
LED106  8.13,14.22 270 top
LED107  8.13,11.43 270 top
LED108  8.13,8.64 270 top
LED109  5.33,56.13 270 top
LED110  5.33,53.34 270 top
LED111  5.33,50.55 270 top
LED112  5.33,47.75 270 top
LED113  5.33,44.96 270 top
LED114  5.33,42.16 270 top
LED115  5.33,39.37 270 top
LED116  5.33,36.58 270 top
LED117  5.33,33.78 270 top
LED118  5.33,30.99 270 top
LED119  5.33,28.19 270 top
LED120  5.33,25.4 270 top
LED121  5.33,22.61 270 top
LED122  5.33,19.81 270 top
LED123  5.33,17.02 270 top
LED124  5.33,14.22 270 top
LED125  5.33,11.43 270 top
LED126  5.33,8.64 270 top
LED127  2.54,56.13 270 top
LED128  2.54,53.34 270 top
LED129  2.54,50.55 270 top
LED130  2.54,47.75 270 top
LED131  2.54,44.96 270 top
LED132  2.54,42.16 270 top
LED133  2.54,39.37 270 top
LED134  2.54,36.58 270 top
LED135  2.54,33.78 270 top
LED136  2.54,30.99 270 top
LED137  2.54,28.19 270 top
LED138  2.54,25.4 270 top
LED139  2.54,22.61 270 top
LED140  2.54,19.81 270 top
LED141  2.54,17.02 270 top
LED142  2.54,14.22 270 top
LED143  2.54,11.43 270 top
LED144  2.54,8.64 270 top
LOGO1  -4.19,-7.11 90 bottom  (outside the outline)
LOGO3  RSNURL_QR_10MM  [RSNURL_QR_10MM]  18.09,51.21 0 bottom
R1  22.23,61.34 270 top
SJ1  20.32,61.34 270 bottom

### Tracks (layer width: path | path; a pad name or v marks a point on that pad's centre or on a via)
3.3V
  Top 0.305: IC1.1 21.77,62.3 R1.1 22.49,61.84 22.99,61.34 22.99,60.2 25.43,57.75 J3.1 25.43,56.19 23.83,54.59 23.83,37.9 J3.9
5V  (via drill 0.35, 0.45, 0.5)
  Top 0.305: LED127.VDD 1.99,56.19 v2.03,56.15 | LED109.VDD 4.78,56.19 v4.83,56.15 | LED91.VDD 7.58,56.19 v7.62,56.15 | LED73.VDD 10.37,56.19 v10.41,56.15 | LED55.VDD 13.17,56.19 v13.21,56.15 | LED37.VDD 15.96,56.19 v16,56.15 | LED19.VDD 18.75,56.19 v18.8,56.15 | LED1.VDD 21.55,56.19 v21.59,56.15 | LED128.VDD 1.99,53.4 v2.03,53.36 | LED110.VDD 4.78,53.4 v4.83,53.36 | LED92.VDD 7.58,53.4 v7.62,53.36 | LED74.VDD 10.37,53.4 v10.41,53.36 | LED56.VDD 13.17,53.4 v13.21,53.36 | LED38.VDD 15.96,53.4 v16,53.36 | LED20.VDD 18.75,53.4 v18.8,53.36 | LED2.VDD 21.55,53.4 v21.59,53.36 | LED111.VDD 4.78,50.6 v4.83,50.56 | LED93.VDD 7.58,50.6 v7.62,50.56 | LED75.VDD 10.37,50.6 v10.41,50.56 | LED57.VDD 13.17,50.6 v13.21,50.56 | LED39.VDD 15.96,50.6 v16,50.56 | LED21.VDD 18.75,50.6 v18.8,50.56 | LED3.VDD 21.55,50.6 v21.59,50.56 | LED130.VDD 1.99,47.81 v2.03,47.77 | LED112.VDD 4.78,47.81 v4.83,47.77 | LED94.VDD 7.58,47.81 v7.62,47.77 | LED76.VDD 10.37,47.81 v10.41,47.77 | LED58.VDD 13.17,47.81 v13.21,47.77 | LED40.VDD 15.96,47.81 v16,47.77 | LED22.VDD 18.75,47.81 v18.8,47.77 | LED4.VDD 21.55,47.81 v21.59,47.77 | LED131.VDD 1.99,45.02 v2.03,44.97 | LED113.VDD 4.78,45.02 v4.83,44.97 | LED95.VDD 7.58,45.02 v7.62,44.97 | LED77.VDD 10.37,45.02 v10.41,44.97 | LED59.VDD 13.17,45.02 v13.21,44.97 | LED41.VDD 15.96,45.02 v16,44.97 | LED23.VDD 18.75,45.02 v18.8,44.97 | LED5.VDD 21.55,45.02 v21.59,44.97 | LED132.VDD 1.99,42.22 v2.03,42.18 | LED114.VDD 4.78,42.22 v4.83,42.18 | LED96.VDD 7.58,42.22 v7.62,42.18 | LED78.VDD 10.37,42.22 v10.41,42.18 | LED60.VDD 13.17,42.22 v13.21,42.18 | LED42.VDD 15.96,42.22 v16,42.18 | LED24.VDD 18.75,42.22 v18.8,42.18 | LED6.VDD 21.55,42.22 v21.59,42.18
  Top 0.305: LED133.VDD 1.99,39.43 v2.03,39.39 | LED115.VDD 4.78,39.43 v4.83,39.39 | LED97.VDD 7.58,39.43 v7.62,39.39 | LED79.VDD 10.37,39.43 v10.41,39.39 | LED61.VDD 13.17,39.43 v13.21,39.39 | LED43.VDD 15.96,39.43 v16,39.39 | LED25.VDD 18.75,39.43 v18.8,39.39 | LED7.VDD 21.55,39.43 v21.59,39.39 | LED134.VDD 1.99,36.63 v2.03,36.59 | LED116.VDD 4.78,36.63 v4.83,36.59 | LED98.VDD 7.58,36.63 v7.62,36.59 | LED80.VDD 10.37,36.63 v10.41,36.59 | LED62.VDD 13.17,36.63 v13.21,36.59 | LED44.VDD 15.96,36.66 v16.02,36.59 | LED26.VDD 18.75,36.63 v18.8,36.59 | LED8.VDD 21.55,36.63 v21.59,36.59 | LED135.VDD 1.99,33.84 v2.03,33.8 | LED117.VDD 4.78,33.84 v4.83,33.8 | LED99.VDD 7.58,33.84 v7.62,33.8 | LED81.VDD 10.37,33.84 v10.41,33.8 | LED63.VDD 13.17,33.84 v13.21,33.8 | LED45.VDD 15.96,33.84 v16,33.8 | LED27.VDD 18.75,33.84 v18.8,33.8 | LED9.VDD 21.55,33.84 v21.59,33.8 | LED10.VDD 21.55,31.05 v21.59,31 | LED28.VDD 18.75,31.05 v18.8,31 | LED46.VDD 15.96,31.05 v16,31 | LED64.VDD 13.17,31.05 v13.21,31 | LED82.VDD 10.37,31.05 v10.41,31 | LED100.VDD 7.58,31.05 v7.62,31 | LED118.VDD 4.78,31.05 v4.83,31 | LED136.VDD 1.99,31.05 v2.03,31 | LED137.VDD 1.99,28.25 v2.03,28.21 | LED119.VDD 4.78,28.25 v4.83,28.21 | LED101.VDD 7.58,28.25 v7.62,28.21 | LED138.VDD 1.99,25.46 v2.03,25.42 | LED120.VDD 4.78,25.46 v4.83,25.42 | LED102.VDD 7.58,25.46 v7.62,25.42 | LED83.VDD 10.37,28.25 v10.41,28.21 | LED84.VDD 10.37,25.46 v10.41,25.42 | LED65.VDD 13.17,28.25 v13.21,28.21 | LED47.VDD 15.96,28.25 v16,28.21 | LED29.VDD 18.75,28.25 v18.8,28.21 | LED11.VDD 21.55,28.25 v21.59,28.21 | LED66.VDD 13.17,25.46 v13.21,25.42 | LED48.VDD 15.96,25.46 v16,25.42 | LED30.VDD 18.75,25.46 v18.8,25.42
  Top 0.305: LED12.VDD 21.55,25.46 v21.59,25.42 | LED139.VDD 1.99,22.66 v2.03,22.62 | LED121.VDD 4.78,22.66 v4.83,22.62 | LED103.VDD 7.58,22.66 v7.62,22.62 | LED85.VDD 10.37,22.66 v10.41,22.62 | LED67.VDD 13.17,22.66 v13.21,22.62 | LED49.VDD 15.96,22.65 16,22.61 v16,22.62 | LED31.VDD 18.75,22.66 v18.8,22.62 | LED13.VDD 21.55,22.66 v21.59,22.62 | LED140.VDD 1.99,19.87 v2.03,19.83 | LED122.VDD 4.78,19.87 v4.83,19.83 | LED104.VDD 7.58,19.87 v7.62,19.83 | LED86.VDD 10.37,19.87 v10.41,19.83 | LED68.VDD 13.17,19.87 v13.21,19.83 | LED50.VDD 15.96,19.87 v16,19.83 | LED32.VDD 18.75,19.87 v18.8,19.83 | LED14.VDD 21.55,19.87 v21.59,19.83 | LED141.VDD 1.99,17.08 v2.03,17.03 | LED123.VDD 4.78,17.08 v4.83,17.03 | LED105.VDD 7.58,17.08 v7.62,17.03 | LED87.VDD 10.37,17.08 v10.41,17.03 | LED69.VDD 13.17,17.08 v13.21,17.03 | LED51.VDD 15.96,17.08 v16,17.03 | LED33.VDD 18.75,17.08 v18.8,17.03 | LED15.VDD 21.55,17.08 v21.59,17.03 | LED16.VDD 21.55,14.28 v21.59,14.24 | LED34.VDD 18.75,14.28 v18.8,14.24 | LED52.VDD 15.96,14.28 v16,14.24 | LED70.VDD 13.17,14.28 v13.21,14.24 | LED88.VDD 10.37,14.28 v10.41,14.24 | LED17.VDD 21.55,11.49 v21.59,11.45 | LED35.VDD 18.75,11.49 v18.8,11.45 | LED53.VDD 15.96,11.49 v16,11.45 | LED54.VDD 15.96,8.69 v16,8.65 | LED36.VDD 18.75,8.69 v18.8,8.65 | LED18.VDD 21.55,8.69 v21.59,8.65 | LED89.VDD 10.37,11.49 v10.41,11.45 | LED71.VDD 13.17,11.49 v13.21,11.45 | LED72.VDD 13.17,8.69 v13.21,8.65 | LED90.VDD 10.37,8.69 v10.41,8.65 | LED142.VDD 1.99,14.28 v2.03,14.24 | LED124.VDD 4.78,14.28 v4.83,14.24 | LED106.VDD 7.58,14.28 v7.62,14.24 | LED143.VDD 1.99,11.49 v2.03,11.45 | LED125.VDD 4.78,11.49 v4.83,11.45 | LED107.VDD 7.58,11.49 v7.62,11.45
  Top 0.305: LED144.VDD 1.99,8.69 v2.03,8.65 | LED126.VDD 4.78,8.69 v4.83,8.65 | LED108.VDD 7.58,8.69 v7.62,8.65 | IC1.6 21.28,60.38 v21.77,59.89 | v2.03,50.56 1.99,50.6 LED129.VDD
  Top 0.813: C3.1 18.74,6.72 v18.75,6.73 | C3.1 v17.42,5.33 | C3.1 18.74,3.98 v18.72,3.96 | v8.59,60.83 C2.1 | v7.24,59.44 C2.1 | v8.59,58.01 8.59,59.43 C2.1 | v9.2,6.73 9.2,5.35 | 9.2,5.35 C4.1 v9.21,3.95 v9.22,3.94 | v7.87,5.33 7.89,5.35 9.2,5.35 | v18.77,59.44 C1.1 | v18.34,58.01 17.46,58.89 C1.1 | v16.82,58.04 17.46,58.68 C1.1
  other vias: 22.78,64.47 28.58,58.22 7.44,64.47 1.42,58.24 0.53,7.16 7.16,0.53 29.46,7.34 22.71,0.61 0.53,32.99 29.46,33.2
  pour Route15 (isolate 0.254, no thermals): 0,-3.81 0,65.15 30.23,65.15 30.23,-3.81
  pour Top (no thermals): 30.23,0 -3.81,0 -3.81,65.15 30.23,65.15
DATA  (via drill 0.35)
  Top 0.152: v19.05,61.34 19.67,61.96 IC1.3
  Bottom 0.152: SJ1.2 v19.05,61.34
DI_FIRST
  Top 0.152: J1.2 16.38,61.21 18.29,61.21 19.12,60.38 IC1.4 19.67,59.91 20.68,58.9 21.74,58.9 22.63,58.01 22.63,57.07 LED1.DI
DO_LAST
  Top 0.152: LED144.DO 1.99,7.66 2.67,6.99 5.08,6.99 11.18,0.89 13.46,0.89 J2.2
DO_MID
  Top 0.152: LED72.DO 12.09,8.8 12.09,56.43 LED73.DI
GND  (via drill 0.35, 0.45, 0.5)
  Top 0.305: v14.22,56.12 14.28,56.07 LED55.GND | LED37.GND 17.07,56.07 v17.02,56.12 | LED19.GND 19.86,55.23 19.86,56.07 v19.81,56.12 | LED1.GND 22.65,56.08 v22.61,56.12 | LED128.GND 3.09,53.28 v3.05,53.32 | LED110.GND 5.88,53.28 v5.84,53.32 | LED129.GND 3.09,50.49 v3.05,50.53 | LED127.GND 3.09,56.08 v3.05,56.12 | LED109.GND 5.88,56.08 v5.84,56.12 | LED91.GND 8.68,56.08 v8.64,56.12 | LED73.GND 11.47,56.08 v11.43,56.12 | LED92.GND 8.68,53.28 v8.64,53.32 | LED74.GND 11.47,53.28 v11.43,53.32 | LED56.GND 14.27,53.28 v14.22,53.32 | LED38.GND 17.06,53.28 v17.02,53.32 | LED20.GND 19.85,53.28 v19.81,53.32 | LED2.GND 22.65,53.28 v22.61,53.32 | LED111.GND 5.88,50.49 v5.84,50.53 | LED93.GND 8.68,50.49 v8.64,50.53 | LED75.GND 11.47,50.49 v11.43,50.53 | LED57.GND 14.27,50.49 v14.22,50.53 | LED39.GND 17.06,50.49 v17.02,50.53 | LED21.GND 19.85,50.49 v19.81,50.53 | LED3.GND 22.65,50.49 v22.61,50.53 | LED130.GND 3.09,47.69 v3.05,47.74 | LED112.GND 5.88,47.69 v5.84,47.74 | LED94.GND 8.68,47.69 v8.64,47.74 | LED76.GND 11.47,47.69 v11.43,47.74 | LED58.GND 14.27,47.69 v14.22,47.74 | LED40.GND 17.06,47.69 v17.02,47.74 | LED22.GND 19.85,47.69 v19.81,47.74 | LED4.GND 22.65,47.69 v22.61,47.74 | LED131.GND 3.09,44.9 v3.05,44.94 | LED113.GND 5.88,44.9 v5.84,44.94 | LED95.GND 8.68,44.9 v8.64,44.94 | LED77.GND 11.47,44.9 v11.43,44.94 | LED59.GND 14.27,44.9 v14.22,44.94 | LED41.GND 17.06,44.9 v17.02,44.94 | LED23.GND 19.85,44.9 v19.81,44.94 | LED5.GND 22.65,44.9 v22.61,44.94 | LED132.GND 3.09,42.11 v3.05,42.15 | LED114.GND 5.88,42.11 v5.84,42.15 | LED96.GND 8.68,42.11 v8.64,42.15 | LED78.GND 11.47,42.11 v11.43,42.15 | LED60.GND 14.27,42.11 v14.22,42.15
  Top 0.305: LED42.GND 17.06,42.11 v17.02,42.15 | LED24.GND 19.85,42.11 v19.81,42.15 | LED6.GND 22.65,42.11 v22.61,42.15 | LED133.GND 3.09,39.31 v3.05,39.35 | LED115.GND 5.88,39.31 v5.84,39.35 | LED97.GND 8.68,39.31 v8.64,39.35 | LED79.GND 11.47,39.33 11.43,39.37 v11.43,39.35 | LED61.GND 14.27,39.31 v14.22,39.35 | LED43.GND 17.06,39.31 v17.02,39.35 | LED25.GND 19.85,39.31 v19.81,39.35 | LED7.GND 22.65,39.31 v22.61,39.35 | LED134.GND 3.09,36.52 v3.05,36.56 | LED116.GND 5.88,36.52 v5.84,36.56 | LED98.GND 8.68,36.52 v8.64,36.56 | LED80.GND 11.47,36.52 v11.43,36.56 | LED62.GND 14.27,36.52 v14.22,36.56 | LED44.GND 17.06,36.53 v17.03,36.56 | LED26.GND 19.85,36.52 v19.81,36.56 | LED8.GND 22.65,36.52 v22.61,36.56 | LED135.GND 3.09,33.72 v3.05,33.77 | LED117.GND 5.88,33.72 v5.84,33.77 | LED99.GND 8.68,33.72 v8.64,33.77 | LED81.GND 11.47,33.72 v11.43,33.77 | LED63.GND 14.27,33.72 v14.22,33.77 | LED45.GND 17.06,33.72 v17.02,33.77 | LED27.GND 19.85,33.72 v19.81,33.77 | LED9.GND 22.65,33.72 v22.61,33.77 | LED10.GND 22.65,30.93 v22.61,30.97 | LED28.GND 19.85,30.93 v19.81,30.97 | LED46.GND 17.06,30.92 v17.01,30.97 | LED64.GND 14.27,30.93 v14.22,30.97 | LED82.GND 11.47,30.93 v11.43,30.97 | LED100.GND 8.68,30.93 v8.64,30.97 | LED118.GND 5.88,30.93 v5.84,30.97 | LED136.GND 3.09,30.93 v3.05,30.97 | LED137.GND 3.09,28.14 v3.05,28.18 | LED119.GND 5.88,28.14 v5.84,28.18 | LED101.GND 8.68,28.14 v8.64,28.18 | LED138.GND 3.09,25.34 v3.05,25.38 | LED120.GND 5.88,25.34 v5.84,25.38 | LED102.GND 8.68,25.34 v8.64,25.38 | LED83.GND 11.47,28.15 11.43,28.19 v11.43,28.18 | LED84.GND 11.47,25.34 v11.43,25.38 | LED65.GND 14.27,28.14 v14.22,28.18 | LED47.GND 17.06,28.14 v17.02,28.18
  Top 0.305: LED29.GND 19.85,28.14 v19.81,28.18 | LED11.GND 22.65,28.14 v22.61,28.18 | LED66.GND 14.27,25.34 v14.22,25.38 | LED48.GND 17.06,25.34 v17.02,25.38 | LED30.GND 19.85,25.34 v19.81,25.38 | LED12.GND 22.65,25.34 v22.61,25.38 | LED139.GND 3.09,22.55 v3.05,22.59 | LED121.GND 5.88,22.55 v5.84,22.59 | LED103.GND 8.68,22.55 v8.64,22.59 | LED85.GND 11.47,22.55 v11.43,22.59 | LED67.GND 14.27,22.55 v14.22,22.59 | LED49.GND 17.06,22.55 v17.02,22.59 | LED31.GND 19.85,22.55 v19.81,22.59 | LED13.GND 22.65,22.55 v22.61,22.59 | LED140.GND 3.09,19.75 v3.05,19.8 | LED122.GND 5.88,19.75 v5.84,19.8 | LED104.GND 8.68,19.75 v8.64,19.8 | LED86.GND 11.47,19.75 v11.43,19.8 | LED68.GND 14.27,19.75 v14.22,19.8 | LED50.GND 17.06,19.75 v17.02,19.8 | LED32.GND 19.85,19.75 v19.81,19.8 | LED14.GND 22.65,19.75 v22.61,19.8 | LED141.GND 3.09,16.95 v3.04,17 | LED123.GND 5.88,16.96 v5.84,17 | LED105.GND 8.68,16.96 v8.64,17 | LED87.GND 11.47,16.96 v11.43,17 | LED69.GND 14.27,16.96 v14.22,17 | LED51.GND 17.06,16.96 v17.02,17 | LED33.GND 19.85,16.96 v19.81,17 | LED15.GND 22.65,16.96 v22.61,17 | LED16.GND 22.65,14.17 v22.61,14.21 | LED34.GND 19.85,14.17 v19.81,14.21 | LED52.GND 17.06,14.17 v17.02,14.21 | LED70.GND 14.27,14.17 v14.22,14.21 | LED88.GND 11.47,14.17 v11.43,14.21 | LED17.GND 22.65,11.37 v22.61,11.41 | LED35.GND 19.85,11.37 v19.81,11.41 | LED53.GND 17.06,11.37 v17.02,11.41 | LED54.GND 17.06,8.58 v17.02,8.62 | LED36.GND 19.85,8.58 v19.81,8.62 | LED18.GND 22.65,8.58 v22.61,8.62 | LED89.GND 11.47,11.37 v11.43,11.41 | LED71.GND 14.27,11.37 v14.22,11.41 | LED72.GND 14.27,8.58 v14.22,8.62 | LED90.GND 11.47,8.58 v11.43,8.62 | LED142.GND 3.09,14.17 v3.05,14.21
  Top 0.305: LED124.GND 5.88,14.17 v5.84,14.21 | LED106.GND 8.68,14.17 v8.64,14.21 | LED143.GND 3.09,11.37 v3.05,11.41 | LED125.GND 5.88,11.37 v5.84,11.41 | LED107.GND 8.68,11.37 v8.63,11.41 | LED144.GND 3.09,8.58 v3.05,8.62 | LED126.GND 5.88,8.58 v5.84,8.62 | LED108.GND 8.68,8.58 v8.64,8.62 | IC1.2 v20.32,64.26
  Top 0.813: C2.2 v11.81,59.44 | C2.2 10.49,59.45 v10.49,60.83 | C2.2 10.54,59.37 v10.54,58.04 | v15.57,60.83 C1.2 | C1.2 v14.2,59.44 | C1.2 v15.56,58.05 v15.57,58.04 | C4.2 v11.11,6.72 v11.1,6.73 | C4.2 v11.11,3.95 v11.1,3.94 | C4.2 v12.45,5.33 | C3.2 20.64,6.7 v20.63,6.71 | C3.2 20.65,5.32 v20.65,3.94 | C3.2 v21.92,5.33
  other vias: 6.93,63.65 0.61,57.76 23.22,63.63 29.46,57.78 28.55,6.96 23.09,1.5 6.83,1.4 1.35,6.73 23.24,58.93 29.46,32.21 0.56,32.05
  pour Bottom (isolate 0.254, no thermals): 0,0 0,65.15 34.54,65.15 34.54,0
  pour Route2 (isolate 0.254, no thermals): 0,0 30.23,0 30.23,68.71 0,68.71
GND1
  cutout Top: 0,5 2,7 5,7 7,5 7,2 5,0 0,0
  cutout Top: 30,0 25,0 23,2 23,5 25,7 28,7 30,5
  cutout Top: 0,65 5,65 7,63 7,60 5,58 2,58 0,60
  cutout Top: 30,65 25,65 23,63 23,60 25,58 28,58 30,60
GND2
  cutout Bottom: 0,0 0,5 2,7 5,7 7,5 7,2 5,0
  cutout Bottom: 30,0 25,0 23,2 23,5 25,7 28,7 30,5
  cutout Bottom: 0,65 5,65 7,63 7,60 5,58 2,58 0,60
  cutout Bottom: 30,65 25,65 23,63 23,60 25,58 28,58 30,60
GPIO10
  Bottom 0.152: SJ1.3 20.53,59.69 21.04,59.19 21.55,59.19 23.57,57.16 23.57,34.24 24.06,33.76 J3.10
GPIO18
  Bottom 0.152: J4.6 27.08,43.91 25.81,45.19 24.87,45.19 23.88,46.18 23.88,57.4 22.48,58.8 22.48,60.71 21.97,61.21 SJ1.4 20.84,61.34
GPIO21
  Bottom 0.152: SJ1.1 20.07,62.99 19.52,62.45 19.3,62.45 18.09,61.24 18.09,59.15 18.49,58.75 21.51,58.75 23.27,57 23.27,11.15 24.82,9.6 25.74,9.6 26.98,8.36 J4.20
N$1
  Top 0.152: LED1.DO 21.61,55.22 22.57,54.26 LED2.DI
N$2
  Top 0.152: LED2.DO 21.61,52.42 22.57,51.46 LED3.DI
N$3
  Top 0.152: LED3.DO 21.61,49.63 22.57,48.67 LED4.DI
N$4
  Top 0.152: LED4.DO 21.61,46.84 22.57,45.87 LED5.DI
N$5
  Top 0.152: LED5.DO 21.61,44.04 22.57,43.08 LED6.DI
N$6
  Top 0.152: LED6.DO 21.61,41.25 22.57,40.28 LED7.DI
N$7
  Top 0.152: LED7.DO 21.61,38.45 22.57,37.49 LED8.DI
N$8
  Top 0.152: LED8.DO 21.61,35.66 22.57,34.7 LED9.DI
N$9
  Top 0.152: LED9.DO 21.61,32.87 22.57,31.9 LED10.DI
N$10
  Top 0.152: LED10.DO 21.61,30.07 22.57,29.11 LED11.DI
N$11
  Top 0.152: LED11.DO 21.61,27.28 22.57,26.32 LED12.DI
N$12
  Top 0.152: LED12.DO 21.61,24.48 22.57,23.52 LED13.DI
N$13
  Top 0.152: LED13.DO 21.61,21.69 22.57,20.73 LED14.DI
N$14
  Top 0.152: LED14.DO 21.61,18.9 22.57,17.93 LED15.DI
N$15
  Top 0.152: LED15.DO 21.61,16.1 22.57,15.14 LED16.DI
N$16
  Top 0.152: LED16.DO 21.61,13.31 22.57,12.35 LED17.DI
N$17
  Top 0.152: LED17.DO 21.61,10.52 22.57,9.55 LED18.DI
N$18
  Top 0.152: LED18.DO 20.5,8.77 20.5,56.41 LED19.DI
N$19
  Top 0.152: LED19.DO 18.81,55.22 19.78,54.26 LED20.DI
N$20
  Top 0.152: LED20.DO 18.81,52.42 19.78,51.46 LED21.DI
N$21
  Top 0.152: LED21.DO 18.81,49.63 19.78,48.67 LED22.DI
N$22
  Top 0.152: LED22.DO 18.81,46.84 19.78,45.87 LED23.DI
N$23
  Top 0.152: LED23.DO 18.81,44.04 19.78,43.08 LED24.DI
N$24
  Top 0.152: LED24.DO 18.81,41.25 19.78,40.28 LED25.DI
N$25
  Top 0.152: LED25.DO 18.81,38.45 19.78,37.49 LED26.DI
N$26
  Top 0.152: LED26.DO 18.81,35.66 19.78,34.7 LED27.DI
N$27
  Top 0.152: LED27.DO 18.81,32.87 19.78,31.9 LED28.DI
N$28
  Top 0.152: LED28.DO 18.81,30.07 19.78,29.11 LED29.DI
N$29
  Top 0.152: LED29.DO 18.81,27.28 19.78,26.32 LED30.DI
N$30
  Top 0.152: LED30.DO 18.81,24.48 19.78,23.52 LED31.DI
N$31
  Top 0.152: LED31.DO 18.81,21.69 19.78,20.73 LED32.DI
N$32
  Top 0.152: LED32.DO 18.81,18.9 19.78,17.93 LED33.DI
N$33
  Top 0.152: LED33.DO 18.81,16.1 19.78,15.14 LED34.DI
N$34
  Top 0.152: LED34.DO 18.81,13.31 19.78,12.35 LED35.DI
N$35
  Top 0.152: LED35.DO 18.81,10.52 19.78,9.55 LED36.DI
N$36
  Top 0.152: LED36.DO 17.68,8.8 17.68,56.43 LED37.DI
N$37
  Top 0.152: LED37.DO 16.02,55.22 16.98,54.26 LED38.DI
N$38
  Top 0.152: LED38.DO 16.02,52.42 16.98,51.46 LED39.DI
N$39
  Top 0.152: LED39.DO 16.02,49.63 16.98,48.67 LED40.DI
N$40
  Top 0.152: LED40.DO 16.02,46.84 16.98,45.87 LED41.DI
N$41
  Top 0.152: LED41.DO 16.02,44.04 16.98,43.08 LED42.DI
N$42
  Top 0.152: LED42.DO 16.02,41.25 16.98,40.28 LED43.DI
N$43
  Top 0.152: LED43.DO 16.02,38.45 16.98,37.49 LED44.DI
N$44
  Top 0.152: LED44.DO 16.02,35.66 16.98,34.7 LED45.DI
N$45
  Top 0.152: LED45.DO 16.02,32.87 16.98,31.9 LED46.DI
N$46
  Top 0.152: LED46.DO 16.02,30.07 16.98,29.11 LED47.DI
N$47
  Top 0.152: LED47.DO 16.02,27.28 16.98,26.32 LED48.DI
N$48
  Top 0.152: LED48.DO 16.02,24.48 16.98,23.52 LED49.DI
N$49
  Top 0.152: LED49.DO 16.02,21.69 16.98,20.73 LED50.DI
N$50
  Top 0.152: LED50.DO 16.02,18.9 16.98,17.93 LED51.DI
N$51
  Top 0.152: LED51.DO 16.02,16.1 16.98,15.14 LED52.DI
N$52
  Top 0.152: LED52.DO 16.02,13.31 16.98,12.35 LED53.DI
N$53
  Top 0.152: LED53.DO 16.02,10.52 16.98,9.55 LED54.DI
N$54
  Top 0.152: LED54.DO 14.88,8.8 14.88,56.43 LED55.DI
N$55
  Top 0.152: LED55.DO 13.23,55.22 14.19,54.26 LED56.DI
N$56
  Top 0.152: LED56.DO 13.23,52.42 14.19,51.46 LED57.DI
N$57
  Top 0.152: LED57.DO 13.23,49.63 14.19,48.67 LED58.DI
N$58
  Top 0.152: LED58.DO 13.23,46.84 14.19,45.87 LED59.DI
N$59
  Top 0.152: LED59.DO 13.23,44.04 14.19,43.08 LED60.DI
N$60
  Top 0.152: LED60.DO 13.23,41.25 14.19,40.28 LED61.DI
N$61
  Top 0.152: LED61.DO 13.23,38.45 14.19,37.49 LED62.DI
N$62
  Top 0.152: LED62.DO 13.23,35.66 14.19,34.7 LED63.DI
N$63
  Top 0.152: LED63.DO 13.23,32.87 14.19,31.9 LED64.DI
N$64
  Top 0.152: LED64.DO 13.23,30.07 14.19,29.11 LED65.DI
N$65
  Top 0.152: LED65.DO 13.23,27.28 14.19,26.32 LED66.DI
N$66
  Top 0.152: LED66.DO 13.23,24.48 14.19,23.52 LED67.DI
N$67
  Top 0.152: LED67.DO 13.23,21.69 14.19,20.73 LED68.DI
N$68
  Top 0.152: LED68.DO 13.23,18.9 14.19,17.93 LED69.DI
N$69
  Top 0.152: LED69.DO 13.23,16.1 14.19,15.14 LED70.DI
N$70
  Top 0.152: LED70.DO 13.23,13.31 14.19,12.35 LED71.DI
N$71
  Top 0.152: LED71.DO 13.23,10.52 14.19,9.55 LED72.DI
N$72
  Top 0.152: LED73.DO 10.43,55.22 11.4,54.26 LED74.DI
N$73
  Top 0.152: LED74.DO 10.43,52.42 11.4,51.46 LED75.DI
N$74
  Top 0.152: LED75.DO 10.43,49.63 11.4,48.67 LED76.DI
N$75
  Top 0.152: LED76.DO 10.43,46.84 11.4,45.87 LED77.DI
N$76
  Top 0.152: LED77.DO 10.43,44.04 11.4,43.08 LED78.DI
N$77
  Top 0.152: LED78.DO 10.43,41.25 11.4,40.28 LED79.DI
N$78
  Top 0.152: LED79.DO 10.43,38.45 11.4,37.49 LED80.DI
N$79
  Top 0.152: LED80.DO 10.43,35.66 11.4,34.7 LED81.DI
N$80
  Top 0.152: LED81.DO 10.43,32.87 11.4,31.9 LED82.DI
N$81
  Top 0.152: LED82.DO 10.43,30.07 11.4,29.11 LED83.DI
N$82
  Top 0.152: LED83.DO 10.43,27.28 11.4,26.32 LED84.DI
N$83
  Top 0.152: LED84.DO 10.43,24.48 11.4,23.52 LED85.DI
N$84
  Top 0.152: LED85.DO 10.43,21.69 11.4,20.73 LED86.DI
N$85
  Top 0.152: LED86.DO 10.43,18.9 11.4,17.93 LED87.DI
N$86
  Top 0.152: LED87.DO 10.43,16.1 11.4,15.14 LED88.DI
N$87
  Top 0.152: LED88.DO 10.43,13.31 11.4,12.35 LED89.DI
N$88
  Top 0.152: LED89.DO 10.43,10.52 11.4,9.55 LED90.DI
N$89
  Top 0.152: LED90.DO 9.3,8.8 9.3,56.43 LED91.DI
N$90
  Top 0.152: LED91.DO 7.64,55.22 8.6,54.26 LED92.DI
N$91
  Top 0.152: LED92.DO 7.64,52.42 8.6,51.46 LED93.DI
N$92
  Top 0.152: LED93.DO 7.64,49.63 8.6,48.67 LED94.DI
N$93
  Top 0.152: LED94.DO 7.64,46.84 8.6,45.87 LED95.DI
N$94
  Top 0.152: LED95.DO 7.64,44.04 8.6,43.08 LED96.DI
N$95
  Top 0.152: LED96.DO 7.64,41.25 8.6,40.28 LED97.DI
N$96
  Top 0.152: LED97.DO 7.64,38.45 8.6,37.49 LED98.DI
N$97
  Top 0.152: LED98.DO 7.64,35.66 8.6,34.7 LED99.DI
N$98
  Top 0.152: LED99.DO 7.64,32.87 8.6,31.9 LED100.DI
N$99
  Top 0.152: LED100.DO 7.64,30.07 8.6,29.11 LED101.DI
N$100
  Top 0.152: LED101.DO 7.64,27.28 8.6,26.32 LED102.DI
N$101
  Top 0.152: LED102.DO 7.64,24.48 8.6,23.52 LED103.DI
N$102
  Top 0.152: LED103.DO 7.64,21.69 8.6,20.73 LED104.DI
N$103
  Top 0.152: LED104.DO 7.64,18.9 8.6,17.93 LED105.DI
N$104
  Top 0.152: LED105.DO 7.64,16.1 8.6,15.14 LED106.DI
N$105
  Top 0.152: LED106.DO 7.64,13.31 8.6,12.35 LED107.DI
N$106
  Top 0.152: LED107.DO 7.64,10.52 8.6,9.55 LED108.DI
N$107
  Top 0.152: LED108.DO 6.5,8.8 6.5,56.43 LED109.DI
N$108
  Top 0.152: LED109.DO 4.84,55.22 5.81,54.26 LED110.DI
N$109
  Top 0.152: LED110.DO 4.84,52.42 5.81,51.46 LED111.DI
N$110
  Top 0.152: LED111.DO 4.84,49.63 5.81,48.67 LED112.DI
N$111
  Top 0.152: LED112.DO 4.84,46.84 5.81,45.87 LED113.DI
N$112
  Top 0.152: LED113.DO 4.84,44.04 5.81,43.08 LED114.DI
N$113
  Top 0.152: LED114.DO 4.84,41.25 5.81,40.28 LED115.DI
N$114
  Top 0.152: LED115.DO 4.84,38.45 5.81,37.49 LED116.DI
N$115
  Top 0.152: LED116.DO 4.84,35.66 5.81,34.7 LED117.DI
N$116
  Top 0.152: LED117.DO 4.84,32.87 5.81,31.9 LED118.DI
N$117
  Top 0.152: LED118.DO 4.84,30.07 5.81,29.11 LED119.DI
N$118
  Top 0.152: LED119.DO 4.84,27.28 5.81,26.32 LED120.DI
N$119
  Top 0.152: LED120.DO 4.84,24.48 5.81,23.52 LED121.DI
N$120
  Top 0.152: LED121.DO 4.84,21.69 5.81,20.73 LED122.DI
N$121
  Top 0.152: LED122.DO 4.84,18.9 5.81,17.93 LED123.DI
N$122
  Top 0.152: LED123.DO 4.84,16.1 5.81,15.14 LED124.DI
N$123
  Top 0.152: LED124.DO 4.84,13.31 5.81,12.35 LED125.DI
N$124
  Top 0.152: LED125.DO 4.84,10.52 5.81,9.55 LED126.DI
N$125
  Top 0.152: LED126.DO 3.71,8.8 3.71,56.43 LED127.DI
N$126
  Top 0.152: LED127.DO 2.05,55.22 3.01,54.26 LED128.DI
N$127
  Top 0.152: LED128.DO 2.05,52.42 3.01,51.46 LED129.DI
N$128
  Top 0.152: LED129.DO 2.05,49.63 3.01,48.67 LED130.DI
N$129
  Top 0.152: LED130.DO 2.05,46.84 3.01,45.87 LED131.DI
N$130
  Top 0.152: LED131.DO 2.05,44.04 3.01,43.08 LED132.DI
N$131
  Top 0.152: LED132.DO 2.05,41.25 3.01,40.28 LED133.DI
N$132
  Top 0.152: LED133.DO 2.05,38.45 3.01,37.49 LED134.DI
N$133
  Top 0.152: LED134.DO 2.05,35.66 3.01,34.7 LED135.DI
N$134
  Top 0.152: LED135.DO 2.05,32.87 3.01,31.9 LED136.DI
N$135
  Top 0.152: LED136.DO 2.05,30.07 3.01,29.11 LED137.DI
N$136
  Top 0.152: LED137.DO 2.05,27.28 3.01,26.32 LED138.DI
N$137
  Top 0.152: LED138.DO 2.05,24.48 3.01,23.52 LED139.DI
N$138
  Top 0.152: LED139.DO 2.05,21.69 3.01,20.73 LED140.DI
N$139
  Top 0.152: LED140.DO 2.05,18.9 3.01,17.93 LED141.DI
N$140
  Top 0.152: LED141.DO 2.05,16.1 3.01,15.14 LED142.DI
N$141
  Top 0.152: LED142.DO 2.05,13.31 3.01,12.35 LED143.DI
N$142
  Top 0.152: LED143.DO 2.05,10.52 3.01,9.55 LED144.DI
N$143
  Top 0.305: R1.2 21.96,60.84 21.46,61.34 20.45,61.34 20.32,61.21 IC1.5

### Text on the board
tPlace: 5V | DI | GND | 2 | 3 | 4 | 5 | 6 | 7 | 8 | 9 | 10 | 11 | 12 | 13 | 14 | 15 | 16 | 17 | 18 | 19 | 20 | 21 | 22 | 23 | 24 | 25 | 26 | 27 | 28 | 29 | 30 | 31 | 32 | 33 | 34 | 35 | 36 | 37 | 38 | 39 | 40 | 5V | DO | GND
bPlace: GPIO21 | GPIO10 | GPIO18 | http://redscorp.net | (c) Andriy Golovnya | LED-zero-SHIM v1.0 | BOTTOM SIDE